# Altium schematic sheet 40_Pin_Connector.SchDoc
size A4; SheetNumber: 7; SheetTotal: 11
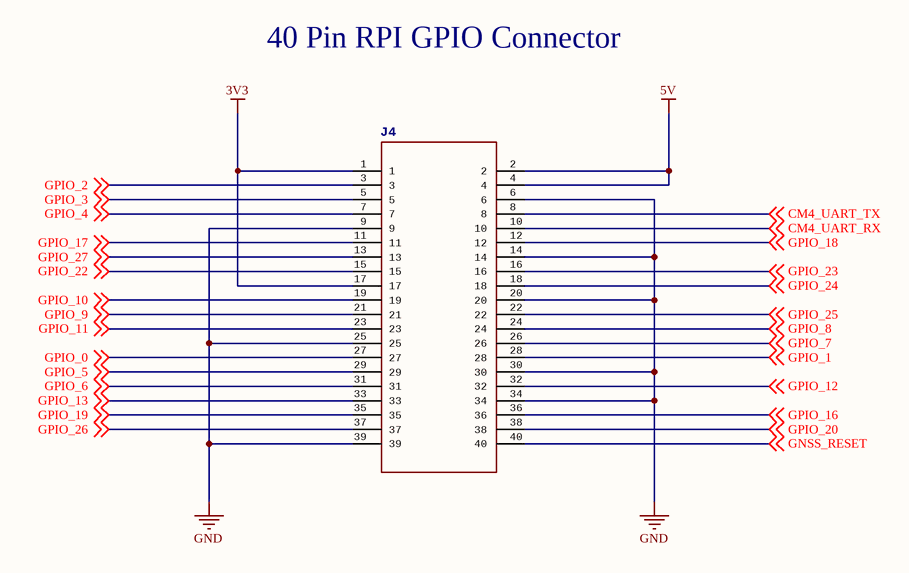
[diagram p0: 40_Pin_Connector.SchDoc]

## Parts
J4  SAMTEC-A-HTSW-120-08-F-DJ  [SAMTEC-A-HTSW-120-08-F-D]  (value not drawn)

## Nets
3V3: J4.1 J4.17
5V: J4.2 J4.4
GND: J4.6 J4.9 J4.14 J4.20 J4.25 J4.30 J4.34 J4.39
CM4_UART_RX: J4.10 ; off-sheet CM4_UART_RX
CM4_UART_TX: J4.8 ; off-sheet CM4_UART_TX
GNSS_RESET: J4.40 ; off-sheet GNSS_RESET
GPIO_0: J4.27 ; off-sheet GPIO_0
GPIO_1: J4.28 ; off-sheet GPIO_1
GPIO_2: J4.3 ; off-sheet GPIO_2
GPIO_3: J4.5 ; off-sheet GPIO_3
GPIO_4: J4.7 ; off-sheet GPIO_4
GPIO_5: J4.29 ; off-sheet GPIO_5
GPIO_6: J4.31 ; off-sheet GPIO_6
GPIO_7: J4.26 ; off-sheet GPIO_7
GPIO_8: J4.24 ; off-sheet GPIO_8
GPIO_9: J4.21 ; off-sheet GPIO_9
GPIO_10: J4.19 ; off-sheet GPIO_10
GPIO_11: J4.23 ; off-sheet GPIO_11
GPIO_12: J4.32 ; off-sheet GPIO_12
GPIO_13: J4.33 ; off-sheet GPIO_13
GPIO_16: J4.36 ; off-sheet GPIO_16
GPIO_17: J4.11 ; off-sheet GPIO_17
GPIO_18: J4.12 ; off-sheet GPIO_18
GPIO_19: J4.35 ; off-sheet GPIO_19
GPIO_20: J4.38 ; off-sheet GPIO_20
GPIO_22: J4.15 ; off-sheet GPIO_22
GPIO_23: J4.16 ; off-sheet GPIO_23
GPIO_24: J4.18 ; off-sheet GPIO_24
GPIO_25: J4.22 ; off-sheet GPIO_25
GPIO_26: J4.37 ; off-sheet GPIO_26
GPIO_27: J4.13 ; off-sheet GPIO_27

## Notes on the sheet
- 40 Pin RPI GPIO Connector